# Altium schematic sheet AnalogMuxingTing.SchDoc
size A4; SheetNumber: 1; SheetTotal: 3; SPICEModelCacheNTODLQRI: <root> / <DocumentId>NTODLQRI</DocumentId> / </root>
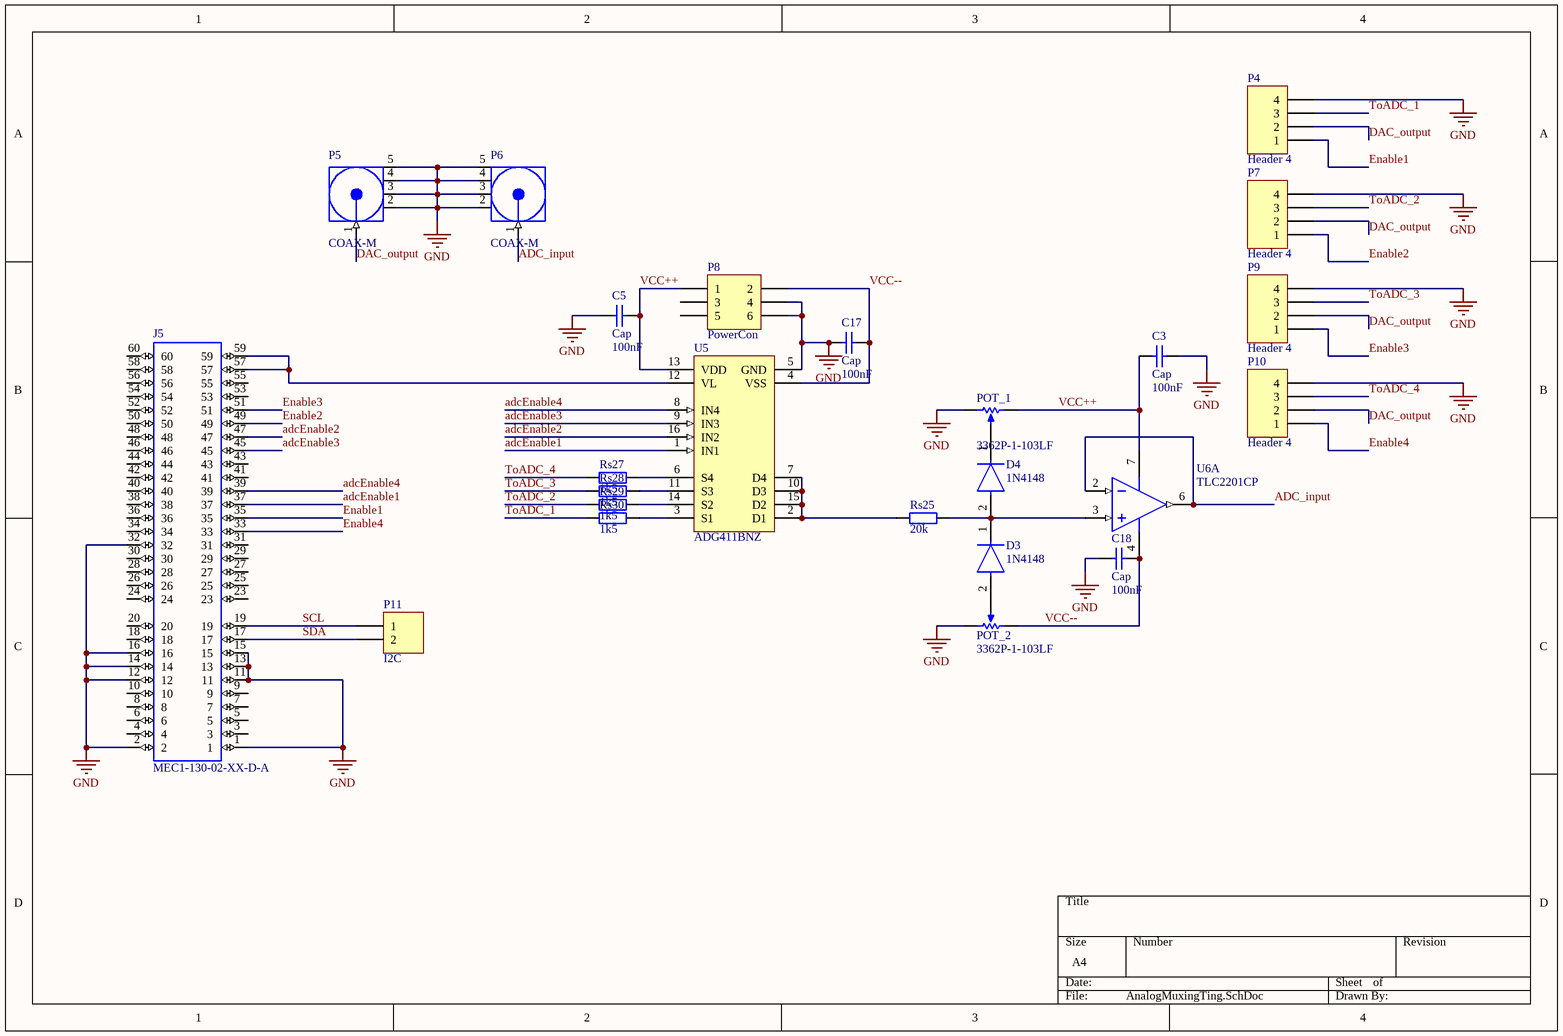
[diagram p0: AnalogMuxingTing.SchDoc]

## Parts
C3  Cap  value 100nF  [RAD-0.2  PCBK]
C5  Cap  value 100nF  [RAD-0.2  PCBK]
C17  Cap  value 100nF  [RAD-0.2  PCBK]
C18  Cap  value 100nF  [RAD-0.2  PCBK]
D3  1N4148  [FP-017AG-MFG]
D4  1N4148  [FP-017AG-MFG]
J5  MEC1-130-02-XX-D-A  [MEC1-130-02-XX-D-A]
P4  Header 4  [HDR1X4]
P5  COAX-M  [BNC_B6251C1-NT3G-50 PCBK]
P6  COAX-M  [BNC_B6251C1-NT3G-50 PCBK]
P7  Header 4  [HDR1X4]
P8  PowerCon  [HDR2X3]
P9  Header 4  [HDR1X4]
P10  Header 4  [HDR1X4]
P11  I2C  [HDR1X2]
POT_1  3362P-1-103LF  [BOUR-3362P]
POT_2  3362P-1-103LF  [BOUR-3362P]
Rs25  20k  [AXIAL-0.4 PCBK]
Rs27  1k5  [AXIAL-0.4 PCBK]
Rs28  1k5  [AXIAL-0.4 PCBK]
Rs29  1k5  [AXIAL-0.4 PCBK]
Rs30  1k5  [AXIAL-0.4 PCBK]
U5  ADG411BNZ  [ADI-N-16]
U6  TLC2201CP  [P0008A]  (part A of 2)

## Nets
GND: C3.1 C5.2 C17.1 C18.1 J5.1 J5.2 J5.11 J5.12 J5.13 J5.14 J5.15 J5.16 J5.32 P4.4 P5.2(GND) P5.3(GND) P5.4(GND) P5.5(GND) P6.2(GND) P6.3(GND) P6.4(GND) P6.5(GND) P7.4 P8.4 P8.6 P9.4 P10.4 POT_1.1(CCW) POT_2.3(CW) U5.5(GND)
ADC_input: P6.1(Signal) U6.2(IN-) U6.6(OUT)
adcEnable1: J5.37 U5.1(IN1)
adcEnable2: J5.47 U5.16(IN2)
adcEnable3: J5.45 U5.9(IN3)
adcEnable4: J5.39 U5.8(IN4)
DAC_output: P4.2 P5.1(Signal) P7.2 P9.2 P10.2
Enable1: J5.35 P4.1
Enable2: J5.49 P7.1
Enable3: J5.51 P9.1
Enable4: J5.33 P10.1
SCL: J5.19 P11.1
SDA: J5.17 P11.2
ToADC_1: P4.3 Rs30.2
ToADC_2: P7.3 Rs29.2
ToADC_3: P9.3 Rs28.2
ToADC_4: P10.3 Rs27.2
VCC++: C3.2 C5.1 P8.1 POT_1.3(CW) U5.13(VDD) U6.7(VDD+)
VCC--: C17.2 C18.2 P8.2 POT_2.1(CCW) U5.4(VSS) U6.4(VDD-/GND)
NetD3_1: D3.1(C) D4.2(A) Rs25.1 U6.3(IN+)
NetD3_2: D3.2(A) POT_2.2(S)
NetD4_1: D4.1(C) POT_1.2(S)
NetJ5_57: J5.57 J5.59 U5.12(VL)
NetRs25_2: Rs25.2 U5.2(D1) U5.7(D4) U5.10(D3) U5.15(D2)
NetRs27_1: Rs27.1 U5.6(S4)
NetRs28_1: Rs28.1 U5.11(S3)
NetRs29_1: Rs29.1 U5.14(S2)
NetRs30_1: Rs30.1 U5.3(S1)

Not connected (* = marked no-connect by the designer): J5 3 4 5 6 7 8 9 10 18 20 23 24 25 26 27 28 29 30 31 34 36 38 40 41 42 43 44 46 48 50 52 53 54 55 56 58 60; P8 3 5

## Library data of the parts
C3 C5 C17 C18 = Cap PCBK: Capacitor; Published: 8-Jun-2000; LatestRevisionDate: 17-Jul-2002; LatestRevisionNote: Re-released for DXP Platform.; PackageReference: RAD-0.3; Publisher: Altium Limited
D3 D4 = CMP-07163-000046-1: DIODE GEN PURP 100V 200MA DO35; Forward Voltage: 1V; Max Power Dissipation: 500mW; Max Reverse Current: 5uA; Forward Current: 300mA; Current: 4A; Reverse Recovery Time: 4ns; Element Configuration: Single; Outside Diameter: 1.85mm; Capacitance: 4pF; Polarity: Standard; Max Forward Surge Current (Ifsm): 1A; Reverse Voltage: 100V; Output Current: 200mA; Average Rectified Current: 200mA; Diameter: 1.91mm; Max Repetitive Reverse Voltage (Vrrm): 100V; Current Rating: 200mA; Case/Package: DO-35; Lead Free: Lead Free; Number of Pins: 2; Recovery Time: 4ns; Packaging: Bulk; Contact Plating: Tin; Voltage: 100V; Mount: Through Hole; Max Surge Current: 4A; Package Quantity: 2000; Width: 1.91mm; Max Reverse Voltage (DC): 100V; Length: 4.56mm; Radiation Hardening: No; Power Dissipation: 500mW; Voltage Rating (DC): 100V; Peak Non-Repetitive Surge Current: 4A; REACH SVHC: No SVHC; Height: 4.56mm; Max Operating Temperature: 175°C; Series: -; Weight: 0.01lb; Min Operating Temperature: -65°C
J5 = MEC1-130-02-XX-D-A: 1MM MINI-EDGE CARD ASSEMBLY.  MANUFACTURER: SAMTEC.; MF: Samtec; Price: None; Value: *; Package: None; Availability: Unavailable; MP: MEC1-130-02-XX-D-A
P4 P7 P9 P10 = Header 4: Header, 4-Pin; LatestRevisionDate: 17-Jul-2002; LatestRevisionNote: Re-released for DXP Platform.; Publisher: Altium Limited
P5 P6 = BNC PCBK: RF Coaxial PCB Connector, MMCX; Thru-Hole, Vertical Mount Plug,  50 Ohm Impedance; PackageDocument: Rev. A, 16-Jun-1997; PCB_Layout: Complies with manufacturer's recommendation.; DrillSize: Corresponds to nominal value.; Published: 15-Jul-2004; LatestRevisionDate: 15-Jul-2004; LatestRevisionNote: Component Replaced.; DatasheetDocument: 30-May-2003; PackageReference: 908-21103; Publisher: Altium Limited; ComponentLink1Description: Manufacturer Link; ComponentLink1URL: http://www.amphenolrf.com/
P8 = Header 3X2: Header, 3-Pin, Dual row; LatestRevisionDate: 17-Jul-2002; LatestRevisionNote: Re-released for DXP Platform.; Publisher: Altium Limited
P11 = Header 2: Header, 2-Pin; LatestRevisionDate: 17-Jul-2002; LatestRevisionNote: Re-released for DXP Platform.; Publisher: Altium Limited
POT_1 POT_2 = CMP-1747-00004-1: Square Trimpot(R) Trimming Potentiometer, 10 KOhm, 300 V, -55 to 125 degC, 3-Pin THD, RoHS, Tube; Voltage Rating: 220 mV; Power Rating: 1 W; Tolerance: 1%; Resistance: 50 mohm; Case/Package: 1206; Length: 3.2 mm; RoHSCompliant: True; PackageDescription: 3-Pin Through Hole Device, Body 6.6 x 6.99 mm, Pitch 2.54 mm; ComponentLink2Description: Datasheet; REACH SVHC: No SVHC; Mount: Surface Mount; Height: 0.6 mm; Packaging: Tape and Reel; ComponentLink1URL: http://www.bourns.com/; Case Code (Imperial): 0612; Pins: 2; Case Code (Metric): 1632; ComponentLink2URL: http://www.bourns.com/docs/Product-Datasheets/3362.pdf; Min Operating Temperature: -25degC; ComponentLink1Description: Manufacturer URL; PackageReference: 3326P; Max Operating Temperature: 125degC; Width: 1.6 mm; Package Quantity: 5000; DatasheetVersion: May-16
Rs25 Rs27-Rs30 = Res PCBK: Resistor; Value: 100; Published: 8-Jun-2000; LatestRevisionDate: 17-Jul-2002; LatestRevisionNote: Re-released for DXP Platform.; PackageReference: AXIAL-0.4; Publisher: Altium Limited
U5 = CMP-0792-00016-1: LC2MOS Precision Quad SPST Switches, 25 Ohm Ron, 16-pin DIP (N-16), Tube; Manufacturer: Analog Devices; Max Pos Supply: +16.5V; # Sw Functions: 4; Max Neg Supply: -16.5V; t ON: 110ns, 175ns; Ron (ohms): 25, 40; Code_JEDEC: MS-001; Configuration: SPST; ComponentLink1Description: Manufacturer URL; DatasheetVersion: Rev. D; PackageVersion: 070706-A, 07/2006; Mounting Technology: Through Hole; ComponentLink2URL: http://www.analog.com/static/imported-files/data_sheets/ADG411_412_413.pdf; ComponentLink3Description: Package Specification; ComponentLink2Description: Datasheet; PackageDescription: 16-Pin Plastic Dual In-Line Package, Row spacing 7.62 mm, Pitch 2.54 mm; Packing: Tube; ComponentLink3URL: http://www.analog.com/static/imported-files/packages/44768431550332N_16.pdf; PartNumber: ADG411BNZ; PackageReference: N-16; ComponentLink1URL: http://www.analog.com/en/index.html
U6 = CMP-0272-02451-3: Low Noise Precision Rail-to-Rail Output Operational Amplifier, 4.6 to 16 V, 0 to 70 degC, 8-pin DIP (P8), Pb-Free (RoHS); Manufacturer: Texas Instruments; Slew Rate(Typ)(V/us): 2.7; Sub Family: Low Noise Amp (<=10nV/rtHz), Low Offset Voltage Amplifier (<=60uV), Precision Amplifier; IIB(Max)(pA): 60; Rating: Catalog; GBW(Typ)(MHz): 1.9; Packing: TUBE; Number of Channels: 1; Total Supply Voltage(Max)(+5V is 5, +/-5V is 10): 16; Total Supply Voltage(Min)(+5V is 5, +/-5V is 10): 4.6; Iq per channel(Max)(mA): 1.5; Offset Drift(Typ)(uV/C): 0.5; CMRR(Min)(dB): 85; ComponentLink1URL: http://www.ti.com/; PackageVersion: 4040082/E, 04/2010; Mounting Technology: Through Hole; ComponentLink3Description: Package Specification; ComponentLink3URL: http://www.ti.com/litv/pdf/mpdi001b; Code_JEDEC: MS-001; Eco-Plan: Pb-Free (RoHS); PackageReference: P0008A; ComponentLink2URL: http://www.ti.com/lit/ds/symlink/tlc2201.pdf; ComponentLink2Description: Datasheet; PartNumber: TLC2201CP; ComponentLink1Description: Manufacturer URL; DatasheetVersion: SLOS175B; Vio (25C)(Max)(mV): 0.5; PackageDescription: 8-Pin Plastic In-Line, Body 9.59 x 6.35 mm, Pitch 2.54 mm